# Altium project BKIT_Project.PrjPcb
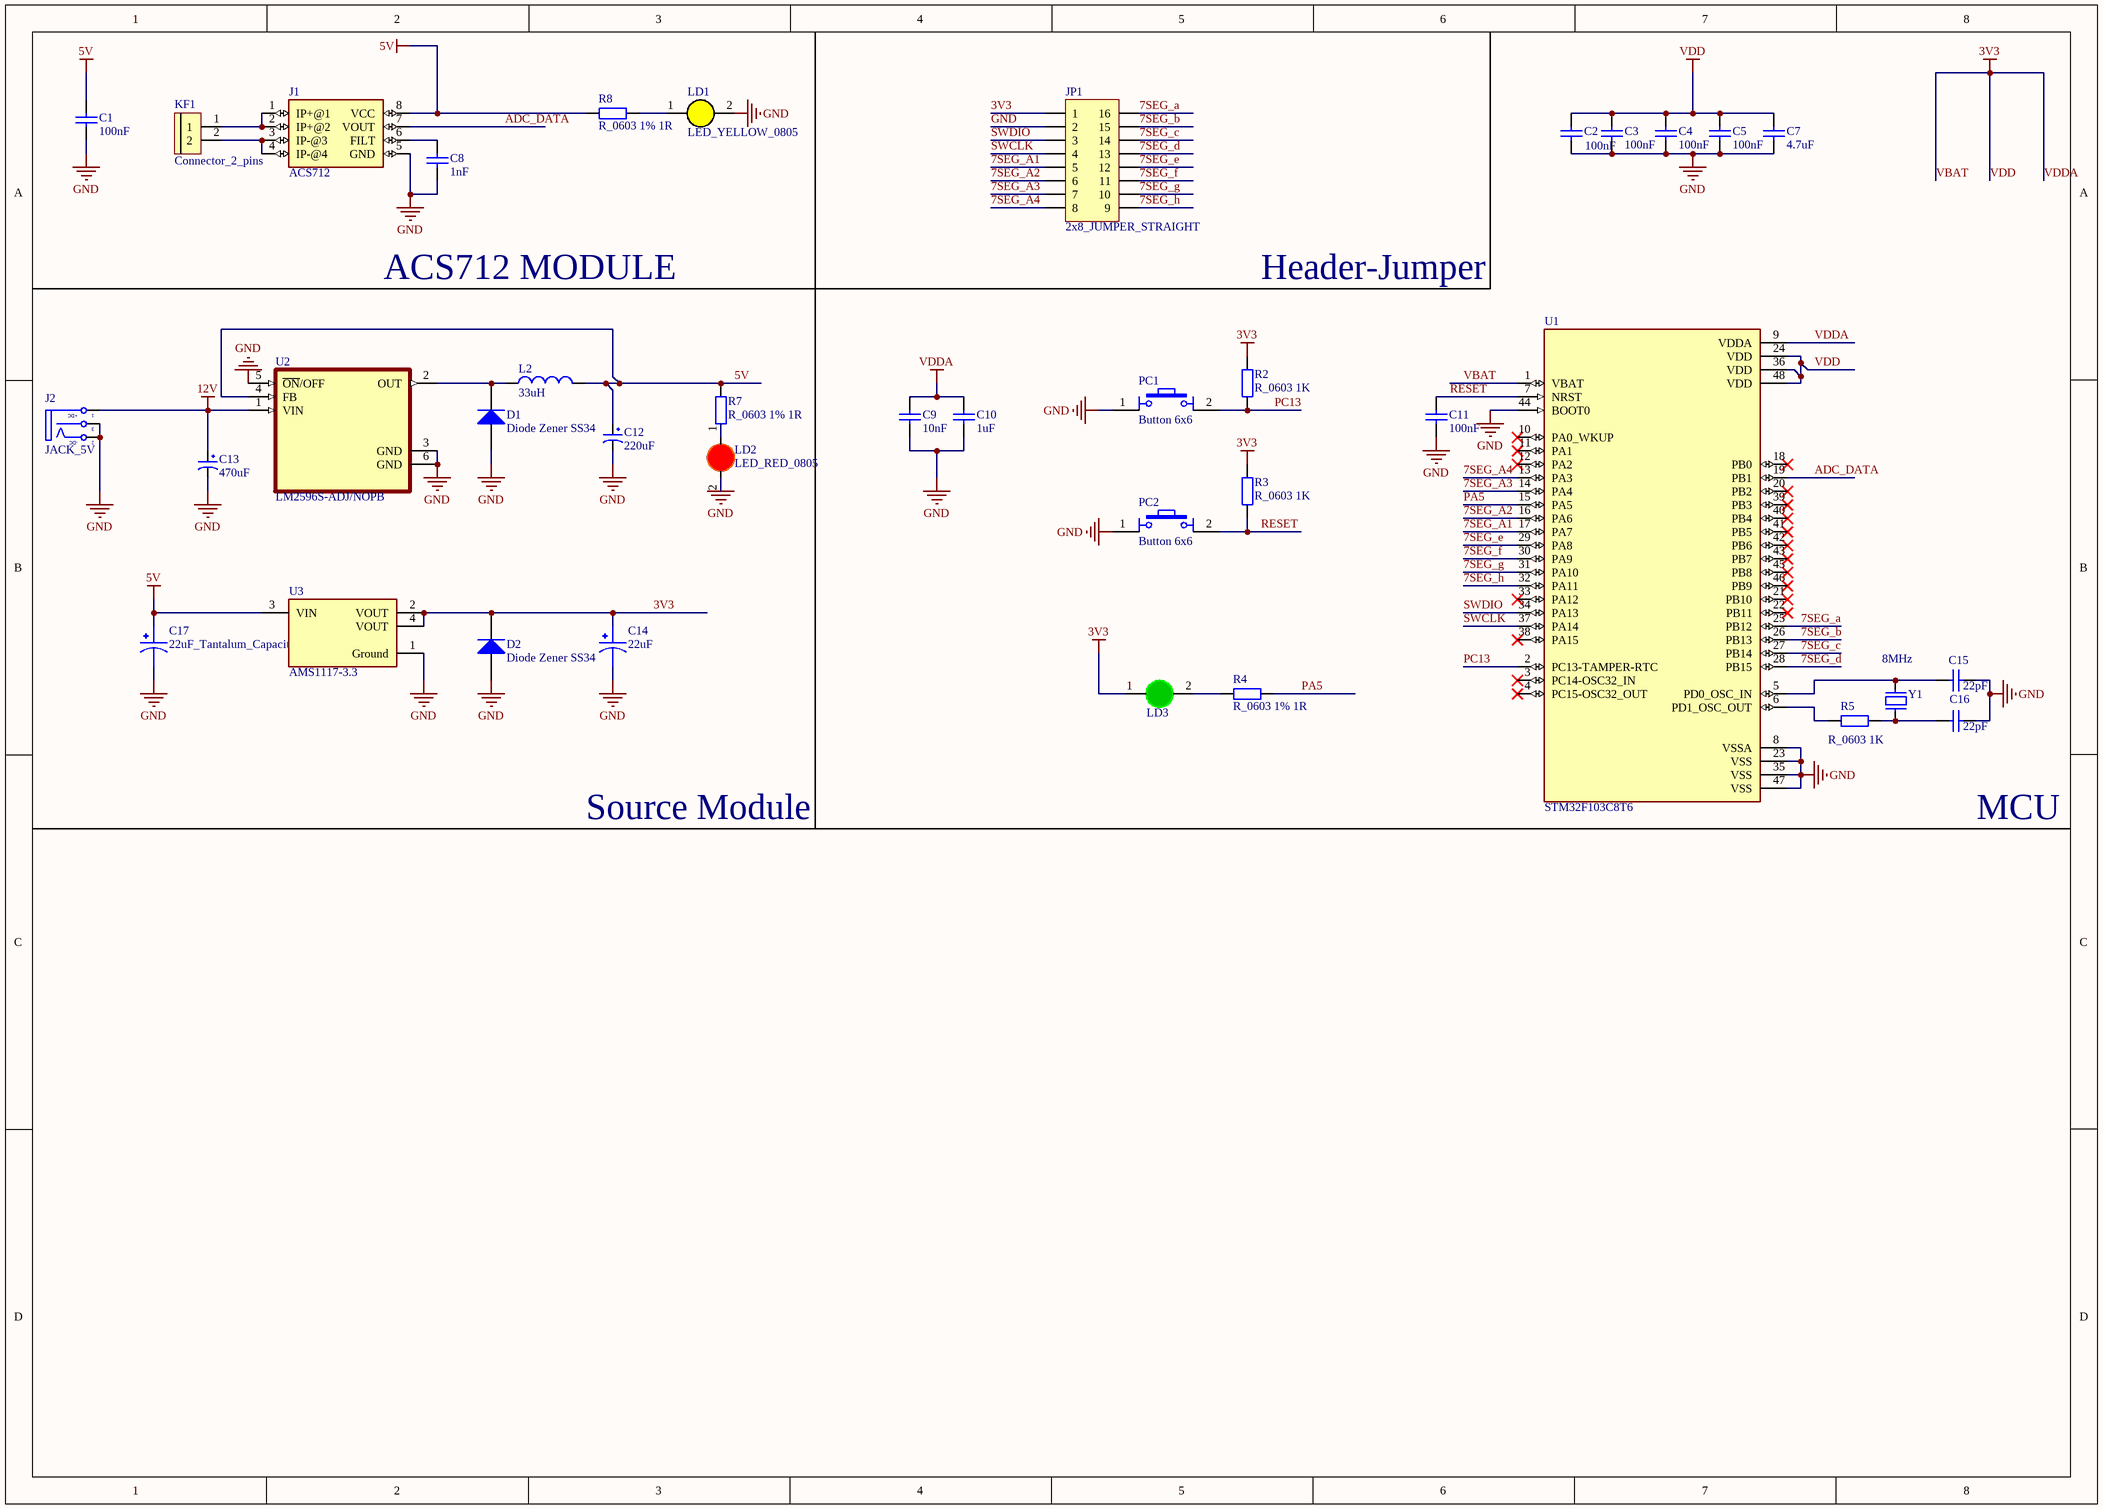
[diagram p0: Total.SchDoc]
1 sheet, 38 parts. Net scope: global (net labels, ports and power ports of the same name join across sheets).
Board file: BKIT_Project.PcbDoc

## Sheet Total.SchDoc
size A3; SheetNumber: 1; SheetTotal: 1

### Parts
C1  100nF  [CAP 0603]
C2  100nF  [CAP 0603]
C3  100nF  [CAP 0603]
C4  100nF  [CAP 0603]
C5  100nF  [CAP 0603]
C7  4.7uF  [CAP 0603]
C8  1nF  [CAP 0603]
C9  10nF  [CAP 0603]
C10  1uF  [CAP 0603]
C11  100nF  [CAP 0603]
C12  220uF  [CAP ALSMD 6.6MM H5.4MM]
C13  470uF  [CAP ALSMD ELEC 10.3MM H10.5MM LEADSPANMAX10.9MM]
C14  22uF  [CAP POL 6032_280]
C15  22pF  [CAP 0603]
C16  22pF  [CAP 0603]
C17  22uF_Tantalum_Capacitor  [CAP POL 6032_280]
D1  Diode Zener SS34  [CAPMP4226X24N]
D2  Diode Zener SS34  [CAPMP4226X24N]
J1  ACS712  [SO08]
J2  JACK_5V  [JACK DC 5.5]
JP1  2x8_JUMPER_STRAIGHT  [JP 2X8 DT]
KF1  Connector_2_pins  [CON2_P196_1729128_TH_ST]
L2  33uH  [CDRH127]
LD1  LED_YELLOW_0805  [LED-0805-Yellow]
LD2  LED_RED_0805  [LED-0805-Red]
LD3  LED_GREEN_0805  [LED-0805-Green]  (value not drawn)
PC1  Button 6x6  [Nut nhan 4 chan cam 6x6]
PC2  Button 6x6  [Nut nhan 4 chan cam 6x6]
R2  R_0603 1K  [TRO SMD 0603]
R3  R_0603 1K  [TRO SMD 0603]
R4  R_0603 1% 1R  [TRO SMD 0603]
R5  R_0603 1K  [TRO SMD 0603]
R7  R_0603 1% 1R  [TRO SMD 0603]
R8  R_0603 1% 1R  [TRO SMD 0603]
U1  STM32F103C8T6  [QFP50P900X900X160-48N]
U2  LM2596S-ADJ/NOPB  [VREG_LM2596S-ADJ/NOPB]
U3  AMS1117-3.3  [FP-AMS1117-IPC_A]
Y1  8MHz  [Thach Anh 2 Chan SMD]

### Nets
3V3: C2.1 C3.2 C4.2 C5.1 C7.1 C9.1 C10.1 C14.1 D2.2 JP1.1 LD3.1(A) R2.2 R3.2 U1.1(VBAT) U1.9(VDDA) U1.24(VDD) U1.36(VDD) U1.48(VDD) U3.2(VOUT) U3.4(VOUT)  [also labelled VBAT, VDD, VDDA]
5V: C1.1 C12.1 C17.1 J1.8(VCC) L2.2 R7.2 R8.1 U2.4(FB) U3.3(VIN)
12V: C13.1 J2.1(T) U2.1(VIN)
GND: C1.2 C2.2 C3.1 C4.1 C5.2 C7.2 C8.2 C9.2 C10.2 C11.1 C12.2 C13.2 C14.2 C15.1 C16.1 C17.2 D1.1 D2.1 J1.5(GND) J2.2(TN) J2.3(S) JP1.2 LD1.2(K) LD2.2(K) PC1.1 PC2.1 U1.8(VSSA) U1.23(VSS) U1.35(VSS) U1.44(BOOT0) U1.47(VSS) U2.3(GND) U2.5(~{ON}/OFF) U2.6(GND) U3.1(Ground)
7SEG_a: JP1.16 U1.25(PB12)
7SEG_A1: JP1.5 U1.17(PA7)
7SEG_A2: JP1.6 U1.16(PA6)
7SEG_A3: JP1.7 U1.14(PA4)
7SEG_A4: JP1.8 U1.13(PA3)
7SEG_b: JP1.15 U1.26(PB13)
7SEG_c: JP1.14 U1.27(PB14)
7SEG_d: JP1.13 U1.28(PB15)
7SEG_e: JP1.12 U1.29(PA8)
7SEG_f: JP1.11 U1.30(PA9)
7SEG_g: JP1.10 U1.31(PA10)
7SEG_h: JP1.9 U1.32(PA11)
ADC_DATA: J1.7(VOUT) U1.19(PB1)
PA5: R4.2 U1.15(PA5)
PC13: PC1.2 R2.1 U1.2(PC13-TAMPER-RTC)
RESET: C11.2 PC2.2 R3.1 U1.7(NRST)
SWCLK: JP1.4 U1.37(PA14)
SWDIO: JP1.3 U1.34(PA13)
NetC8_1: C8.1 J1.6(FILT)
NetC15_2: C15.2 U1.5(PD0_OSC_IN) Y1.2
NetC16_2: C16.2 R5.2 Y1.1
NetD1_2: D1.2 L2.1 U2.2(OUT)
NetJ1_1: J1.1(IP+@1) J1.2(IP+@2) KF1.1
NetJ1_3: J1.3(IP-@3) J1.4(IP-@4) KF1.2
NetLD1_1: LD1.1(A) R8.2
NetLD2_1: LD2.1(A) R7.1
NetLD3_2: LD3.2(K) R4.1
NetR5_1: R5.1 U1.6(PD1_OSC_OUT)

Not connected (* = marked no-connect by the designer): U1 3(PC14-OSC32_IN)* 4(PC15-OSC32_OUT)* 10(PA0_WKUP)* 11(PA1)* 12(PA2)* 18(PB0)* 20(PB2)* 21(PB10)* 22(PB11)* 33(PA12)* 38(PA15)* 39(PB3)* 40(PB4)* 41(PB5)* 42(PB6)* 43(PB7)* 45(PB8)* 46(PB9)*

### Notes on the sheet
- ACS712 MODULE
- Header-Jumper
- Source Module
- MCU
- (in symbol JACK_5V) +DC; -DC

### Library data of the parts
C1-C5 C11 = 100nF_0603_Ceramic_Capacitor
C7 = 4.7uF_0603_Ceramic_Capacitor
C8 = 1nF_0603_Ceramic_Capacitor
C9 = 10nF_0603_Ceramic_Capacitor
C10 = 1uF_0603_Ceramic_Capacitor
C12 = 220uF_10V_Alumium_Capacitor
C13 = 470uF_25V_Alumium_Capacitor
C14 = 22uF_Tantalum_Capacitor
C15 C16 = 22pF_50V_0603_Ceramic_Capacitor
J1 = ACS712: Current Sensor 20A 1 Channel Hall Effect, Open Loop Bidirectional 8-SOIC (0.154, 3.90mm Width); MF: Allegro MicroSystems; SnapEDA_Link: https://www.snapeda.com/parts/ACS712/Allegro+MicroSystems+LLC/view-part/?ref=snap; Package: PowerWFQFN-12 Allegro MicroSystems LLC; Value: *; MP: ACS712; Check_prices: https://www.snapeda.com/parts/ACS712/Allegro+MicroSystems+LLC/view-part/?ref=eda
L2 = 4.2A_33uH_CDRH127
R2 R3 R5 = R_0603 1% 1R
U1 = STM32F103C8T6: ARM® Cortex®-M3 STM32F1 Microcontroller IC 32-Bit 72MHz 64KB (64K x 8) FLASH 48-LQFP (7x7); MF: STMicroelectronics; SnapEDA_Link: https://www.snapeda.com/parts/STM32F103C8T6/STMicroelectronics/view-part/?ref=snap; Package: LQFP-48 STMicroelectronics; Value: *; MP: STM32F103C8T6; Check_prices: https://www.snapeda.com/parts/STM32F103C8T6/STMicroelectronics/view-part/?ref=eda
U2 = LM2596S-ADJ/NOPB: SIMPLE SWITCHERÂ® 4.5V to 40V, 3A Low Component Count Step-Down Regulator; MF: Texas Instruments; SnapEDA_Link: https://www.snapeda.com/parts/LM2596S-ADJ/NOPB/Texas+Instruments/view-part/?ref=snap; Package: TO-263-5 Texas Instruments; Value: *; MP: LM2596S-ADJ/NOPB; Check_prices: https://www.snapeda.com/parts/LM2596S-ADJ/NOPB/Texas+Instruments/view-part/?ref=eda
U3 = CMP-209535-000001-1: LDO Voltage Regulators 1A, 3.3V; Manufacturer: Advanced Monolithic Systems; Dropout Voltage: 1.1V; Output Type: Fixed; Nominal Supply Current: 5mA; Max Power Dissipation: 1.2W; Max Supply Voltage: 15V; Number Of Outputs: 1; Standoff Height: 0.64mm; Max Junction Temp: +125°C; Height: 1.8mm; Package: AMS1117; Device Class L2: Power Management ICs; ComponentLink2Description: Datasheet; ComponentLink2URL: http://www.advanced-monolithic.com/pdf/ds1117.pdf; Category: IC; RoHS: TRUE; Automotive: No; Device Class L1: Integrated Circuits (ICs); Output Current: 1A; Device Class L3: Voltage Regulators - Linear; Temperature: -40°C to +125°C; Output Voltage: 3.3V; Manufacturer Part Number: AMS1117-3.3; Temperature Range Low: -40°C; Octopart: https://octopart.com/ams1117-3.3-advanced+monolithic+systems-25899300; Lead Free: Yes; Ipc Land Pattern Name: SOT229P700X180-4; Temperature Range High: +125°C
Y1 = 8MHz_Crystal_2p_SMD